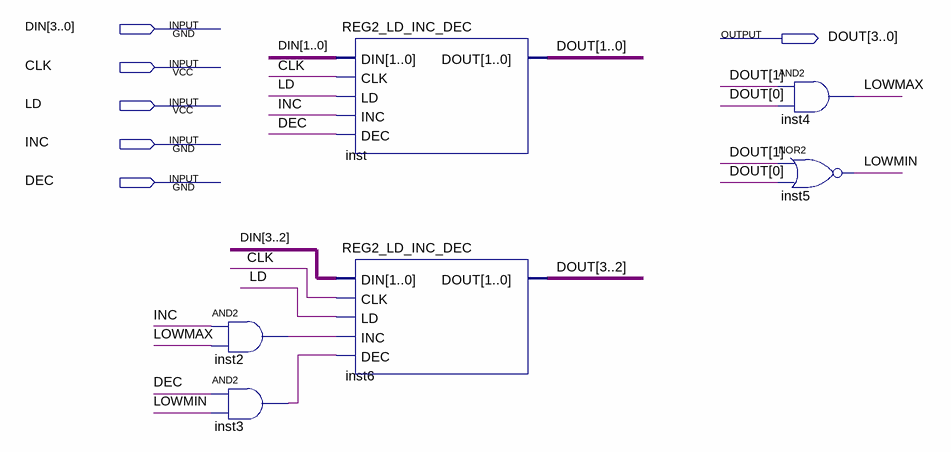
[diagram p0: schematic sheet]
// Quartus schematic REG4_LD_INC_DEC.bdf as structural Verilog: 6 symbols, 6 pins
module REG4_LD_INC_DEC (
  input  [3:0] DIN,
  input  CLK,
  input  LD,
  input  INC,
  input  DEC,
  output [3:0] DOUT
);

  wire inst2_out, inst3_out, LOWMAX, LOWMIN;

  and inst2 (inst2_out, INC, LOWMAX);
  and inst3 (inst3_out, DEC, LOWMIN);
  REG2_LD_INC_DEC inst (.DIN(DIN[1:0]), .CLK(CLK), .LD(LD), .INC(INC), .DEC(DEC), .DOUT(DOUT[1:0]));
  REG2_LD_INC_DEC inst6 (.DIN(DIN[3:2]), .CLK(CLK), .LD(LD), .INC(inst2_out), .DEC(inst3_out), .DOUT(DOUT[3:2]));
  and inst4 (LOWMAX, DOUT[1], DOUT[0]);
  nor inst5 (LOWMIN, DOUT[1], DOUT[0]);
endmodule
